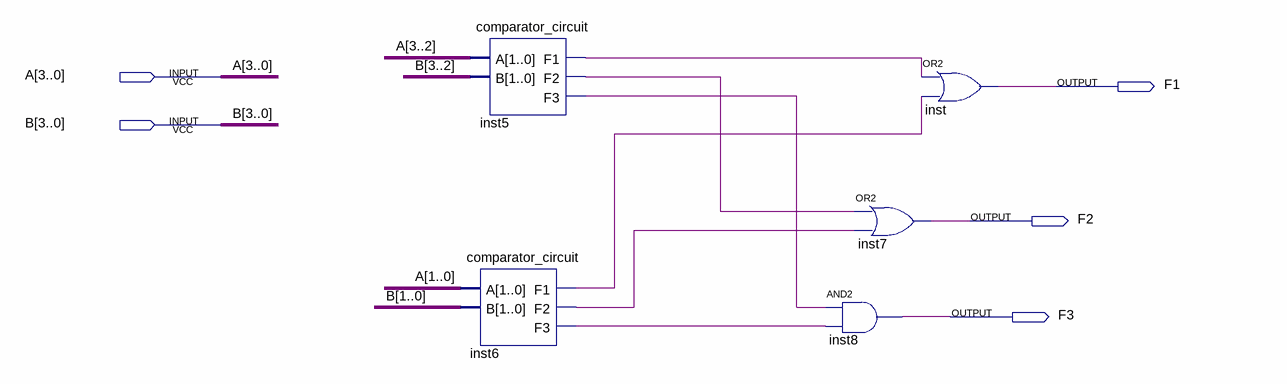
[diagram p0: schematic sheet]
// Quartus schematic comparator.bdf as structural Verilog: 5 symbols, 5 pins
module comparator (
  input  [3:0] A,
  input  [3:0] B,
  output F1,
  output F2,
  output F3
);

  wire inst5_f1, inst5_f2, inst5_f3, inst6_f1, inst6_f2, inst6_f3;

  comparator_circuit inst5 (.A(A[3:2]), .B(B[3:2]), .F1(inst5_f1), .F2(inst5_f2), .F3(inst5_f3));
  comparator_circuit inst6 (.A(A[1:0]), .B(B[1:0]), .F1(inst6_f1), .F2(inst6_f2), .F3(inst6_f3));
  or inst7 (F2, inst5_f2, inst6_f2);
  and inst8 (F3, inst5_f3, inst6_f3);
  or inst (F1, inst5_f1, inst6_f1);
endmodule
